# Altium schematic sheet Sheet1.SchDoc
size A4
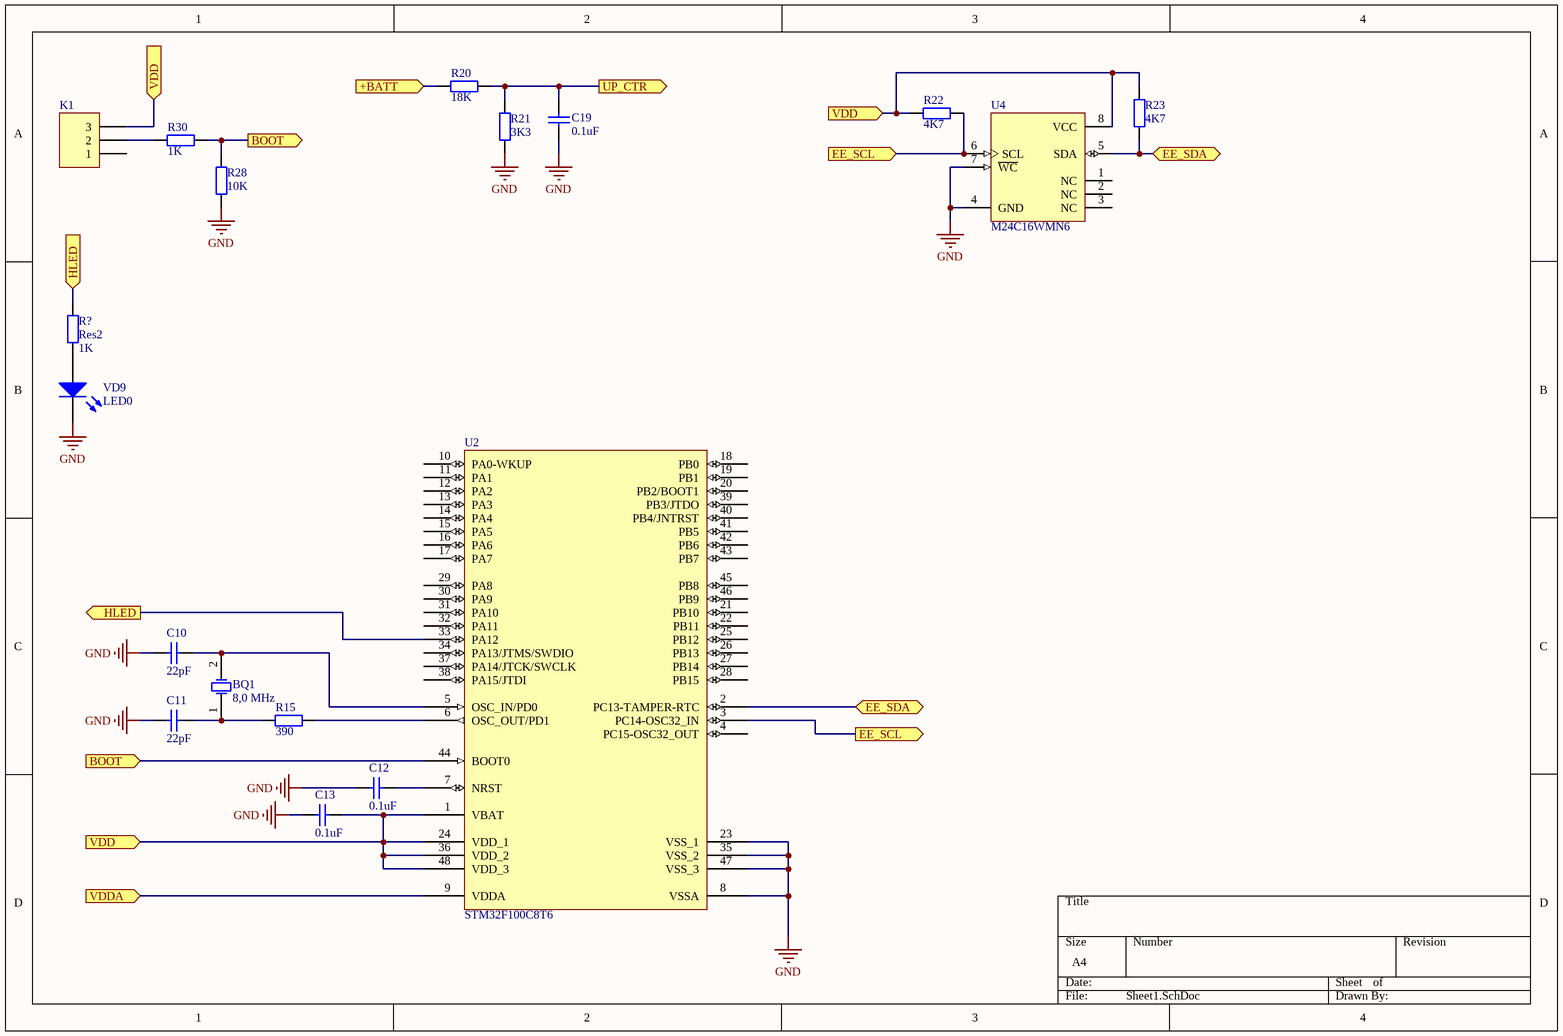
[diagram p0: Sheet1.SchDoc]

## Parts
BQ1  8,0 MHz  [R38]
C10  22pF  [0805]
C11  22pF  [RAD-0.3]
C12  0.1uF  [1206]
C13  0.1uF  [RAD-0.3]
C19  0.1uF  [RAD-0.3]
K1  Header 3  [HDR1X3]  (value not drawn)
R15  390  [1206]
R20  18K  [AXIAL-0.4]
R21  3K3  [AXIAL-0.4]
R22  4K7  [1206]
R23  4K7  [1206]
R28  10K  [1206]
R30  1K  [1206]
R?  Res2  value 1K  [AXIAL-0.4]
U2  STM32F100C8T6  [LQFP48_L]
U4  M24C16WMN6  [SOP8_M]
VD9  LED0  [1206]

## Ports
+BATT (in), BOOT (in), BOOT (out), EE_SCL (in), EE_SCL (out), EE_SDA (bidir), HLED (in), HLED (out), UP_CTR (out), VDD (in), VDDA (in)

## Nets
GND: C10.1 C11.1 C12.1 C13.1 C19.1 R21.1 R28.1 U2.8(VSSA) U2.23(VSS_1) U2.35(VSS_2) U2.47(VSS_3) U4.4(GND) U4.7(~{WC}) VD9.2(K)
+BATT: R20.1 ; port +BATT
BOOT: R28.2 R30.2 U2.44(BOOT0) ; port BOOT
EE_SCL: R22.2 U2.3(PC14-OSC32_IN) U4.6(SCL) ; port EE_SCL
EE_SDA: R23.1 U2.2(PC13-TAMPER-RTC) U4.5(SDA) ; port EE_SDA
HLED: R?.2 U2.33(PA12) ; port HLED
UP_CTR: C19.2 R20.2 R21.2 ; port UP_CTR
VDD: C13.2 K1.3 R22.1 R23.2 U2.1(VBAT) U2.24(VDD_1) U2.36(VDD_2) U2.48(VDD_3) U4.8(VCC) ; port VDD
VDDA: U2.9(VDDA) ; port VDDA
NetBQ1_1: BQ1.1(OSC1) C11.2 R15.1
NetBQ1_2: BQ1.2(OSC2) C10.2 U2.5(OSC_IN/PD0)
NetC12_2: C12.2 U2.7(NRST)
NetK1_2: K1.2 R30.1
NetR15_2: R15.2 U2.6(OSC_OUT/PD1)
NetR?_1: R?.1 VD9.1(A)

Not connected (* = marked no-connect by the designer): K1 1; U2 4(PC15-OSC32_OUT) 10(PA0-WKUP) 11(PA1) 12(PA2) 13(PA3) 14(PA4) 15(PA5) 16(PA6) 17(PA7) 18(PB0) 19(PB1) 20(PB2/BOOT1) 21(PB10) 22(PB11) 25(PB12) 26(PB13) 27(PB14) 28(PB15) 29(PA8) 30(PA9) 31(PA10) 32(PA11) 34(PA13/JTMS/SWDIO) 37(PA14/JTCK/SWCLK) 38(PA15/JTDI) 39(PB3/JTDO) 40(PB4/JNTRST) 41(PB5) 42(PB6) 43(PB7) 45(PB8) 46(PB9); U4 1(NC) 2(NC) 3(NC)

## Library data of the parts
BQ1 = XTAL: Crystal Oscillator; Published: 8-Jun-2000; LatestRevisionDate: 17-Jul-2002; LatestRevisionNote: Re-released for DXP Platform.; PackageReference: R38; Publisher: Altium Limited; PackageDescription: Crystal, Thru-Hole; 2 Leads; Body 3.1 x 8.2 mm (Dia.xH); Frequence: 8,0 MHz
C10-C13 C19 = Cap: Capacitor; Published: 8-Jun-2000; LatestRevisionDate: 17-Jul-2002; LatestRevisionNote: Re-released for DXP Platform.; PackageReference: RAD-0.3; Publisher: Altium Limited; PackageDescription: Radial Cap, Thru-Hole; 2 Leads; 0.3 in Pin Spacing
  C10 C11: Value: 22pF
  C12 C13 C19: Value: 0.1uF
K1 = Header 3: Header, 3-Pin; LatestRevisionDate: 17-Jul-2002; LatestRevisionNote: Re-released for DXP Platform.; Publisher: Altium Limited
R15 R20-R23 R28 R30 R? = Res2: Resistor; Published: 8-Jun-2000; LatestRevisionDate: 17-Jul-2002; LatestRevisionNote: Re-released for DXP Platform.; PackageReference: AXIAL-0.4; Publisher: Altium Limited; PackageDescription: Axial Device, Thru-Hole; 2 Leads; 0.4 in Pin Spacing
  R15: Value: 390
  R20: Value: 18K
  R21: Value: 3K3
  R22 R23: Value: 4K7
  R28: Value: 10K
  R30: Value: 1K
U2 = STM32F101C8T6: STM32 ARM-based 32-bit MCU with 64 Kbytes Flash, 48-pin LQFP, Industrial Temperature; Published: 30-May-2008; DatasheetVersion: rev6, Mar-2008; PackageVersion: Mar-2008; PackageReference: LQFP48; Publisher: Altium Limited; PackageDescription: 48-Pin Low-Profile Quad Flat Pack, 7 x 7 mm Body, 0.5 mm Pitch (LQFP48); ComponentLink1Description: Manufacturer Link; ComponentLink1URL: www.st.com/stm32; ComponentLink2Description: Datasheet; ComponentLink2URL: http://www.st.com/stonline/products/literature/ds/13586.pdf
U4 = M24C16WMN6: 16Kbit Serial IІC Bus EEPROM; Published: 24-Aug-2001; LatestRevisionDate: 13-Apr-2006; LatestRevisionNote: IPC-7351 Footprint Added.; DatasheetVersion: Sep-1999; PackageVersion: Jul-1999; PackageReference: SOP8; Publisher: Altium Limited; PackageDescription: 8-Pin Small Outline Integrated Circuit 1.27 mm Pitch; ComponentLink1Description: Manufacturer Link; ComponentLink1URL: http://www.st.com/; ComponentLink2Description: Datasheet; ComponentLink2URL: http://www.st.com/stonline/products/literature/ds/5067/m24c01-r.pdf
VD9 = LED0: Typical INFRARED GaAs LED; Published: 8-Jun-2000; LatestRevisionDate: 08-Jul-2005; LatestRevisionNote: Mech Layer 1 removed.; PackageReference: LED-0; Publisher: Altium Limited; PackageDescription: LED; 2 Leads